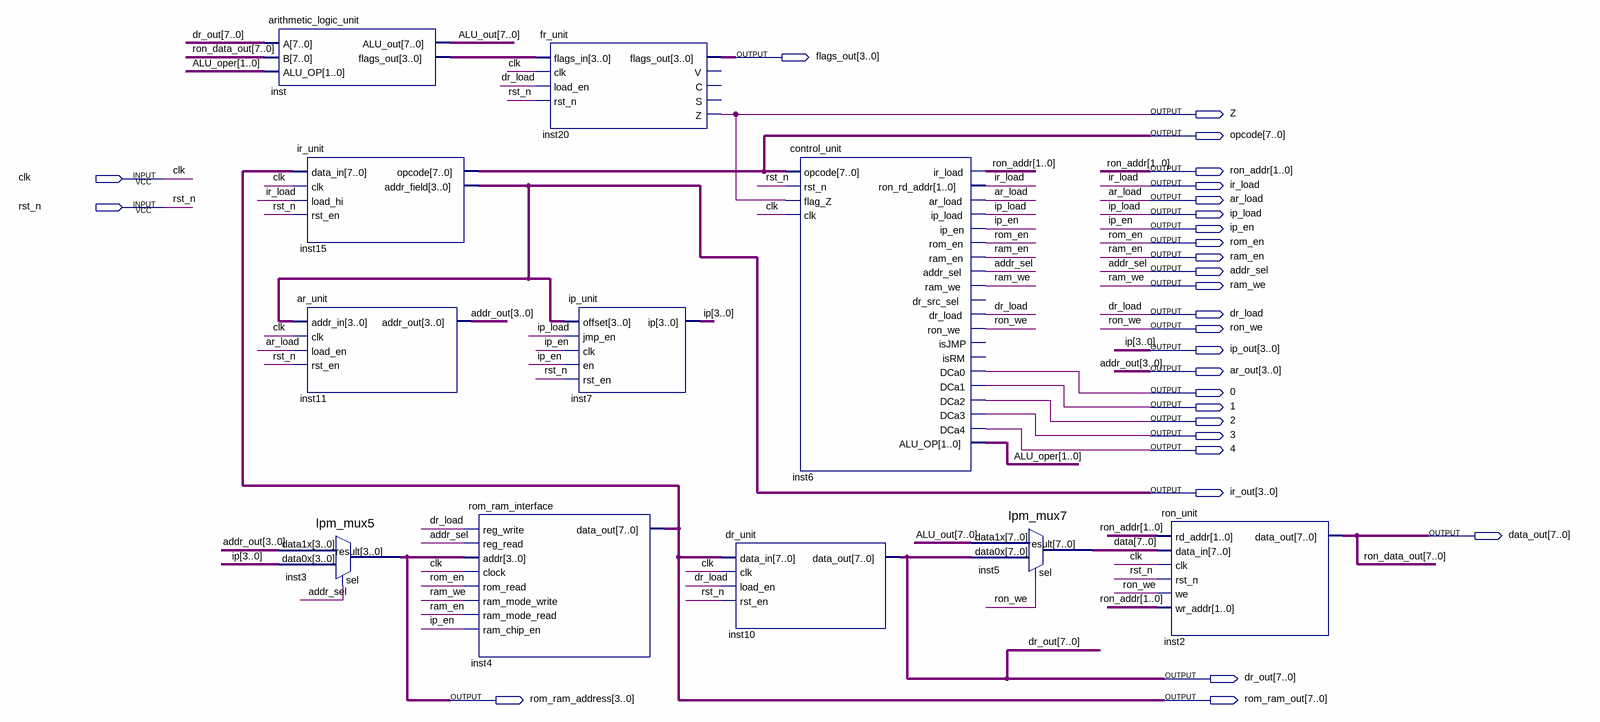
[diagram p0: schematic sheet]
// Quartus schematic lab5_var4_v1.bdf as structural Verilog: 11 symbols, 28 pins
module lab5_var4_v1 (
  input  clk,
  input  rst_n,
  output [3:0] flags_out,
  output Z,
  output [7:0] opcode,
  output [1:0] ron_addr,
  output ir_load,
  output ar_load,
  output ip_load,
  output ip_en,
  output rom_en,
  output ram_en,
  output addr_sel,
  output ram_we,
  output dr_load,
  output ron_we,
  output [3:0] ip_out,
  output [3:0] ar_out,
  output \0 ,
  output \1 ,
  output \2 ,
  output \3 ,
  output \4 ,
  output [3:0] ir_out,
  output [7:0] data_out,
  output [7:0] dr_out,
  output [3:0] rom_ram_address,
  output [7:0] rom_ram_out
);

  wire [1:0] ALU_oper;
  wire [3:0] inst_flags_out;
  wire [7:0] ALU_out, data;

  arithmetic_logic_unit inst (
    .A(dr_out), .B(data_out), .ALU_OP(ALU_oper), .ALU_out(ALU_out), .flags_out(inst_flags_out));
  lpm_mux5 inst3 (.data1x(ar_out), .data0x(ip_out), .sel(addr_sel), .result(rom_ram_address));
  ir_unit inst15 (
    .data_in(rom_ram_out), .clk(clk), .load_hi(ir_load), .rst_en(rst_n), .opcode(opcode), .addr_field(ir_out));
  ar_unit inst11 (.addr_in(ir_out), .clk(clk), .load_en(ar_load), .rst_en(rst_n), .addr_out(ar_out));
  rom_ram_interface inst4 (
    .reg_write(dr_load), .reg_read(addr_sel), .addr(rom_ram_address), .clock(clk), .rom_read(rom_en),
    .ram_mode_write(ram_we), .ram_mode_read(ram_en), .ram_chip_en(ip_en), .data_out(rom_ram_out));
  fr_unit inst20 (
    .flags_in(inst_flags_out), .clk(clk), .load_en(dr_load), .rst_n(rst_n), .flags_out(flags_out), .Z(Z));  // open: V, C, S
  ip_unit inst7 (.offset(ir_out), .jmp_en(ip_load), .clk(ip_en), .en(ip_en), .rst_en(rst_n), .ip(ip_out));
  dr_unit inst10 (.data_in(rom_ram_out), .clk(clk), .load_en(dr_load), .rst_en(rst_n), .data_out(dr_out));
  control_unit inst6 (
    .opcode(opcode), .rst_n(rst_n), .flag_Z(Z), .clk(clk), .ir_load(ron_addr), .ron_rd_addr(ir_load),
    .ar_load(ar_load), .ip_load(ip_load), .ip_en(ip_en), .rom_en(rom_en), .ram_en(ram_en),
    .addr_sel(addr_sel), .ram_we(ram_we), .dr_load(dr_load), .ron_we(ron_we), .DCa0(\0 ), .DCa1(\1 ),
    .DCa2(\2 ), .DCa3(\3 ), .DCa4(\4 ), .ALU_OP(ALU_oper));  // open: dr_src_sel, isJMP, isRM
  lpm_mux7 inst5 (.data1x(ALU_out), .data0x(dr_out), .sel(ron_we), .result(data));
  ron_unit inst2 (
    .rd_addr(ron_addr), .data_in(data), .clk(clk), .rst_n(rst_n), .we(ron_we), .wr_addr(ron_addr),
    .data_out(data_out));

  // Other names for the same wires on the sheet: addr_out[3:0] = ar_out; ron_data_out[7:0] = data_out;
  //   ip[3:0] = ip_out
endmodule
